# Altium schematic sheet ARCHITECTURE.SchDoc: Architecture
size 420 x 297 mm; SheetNumber: 1
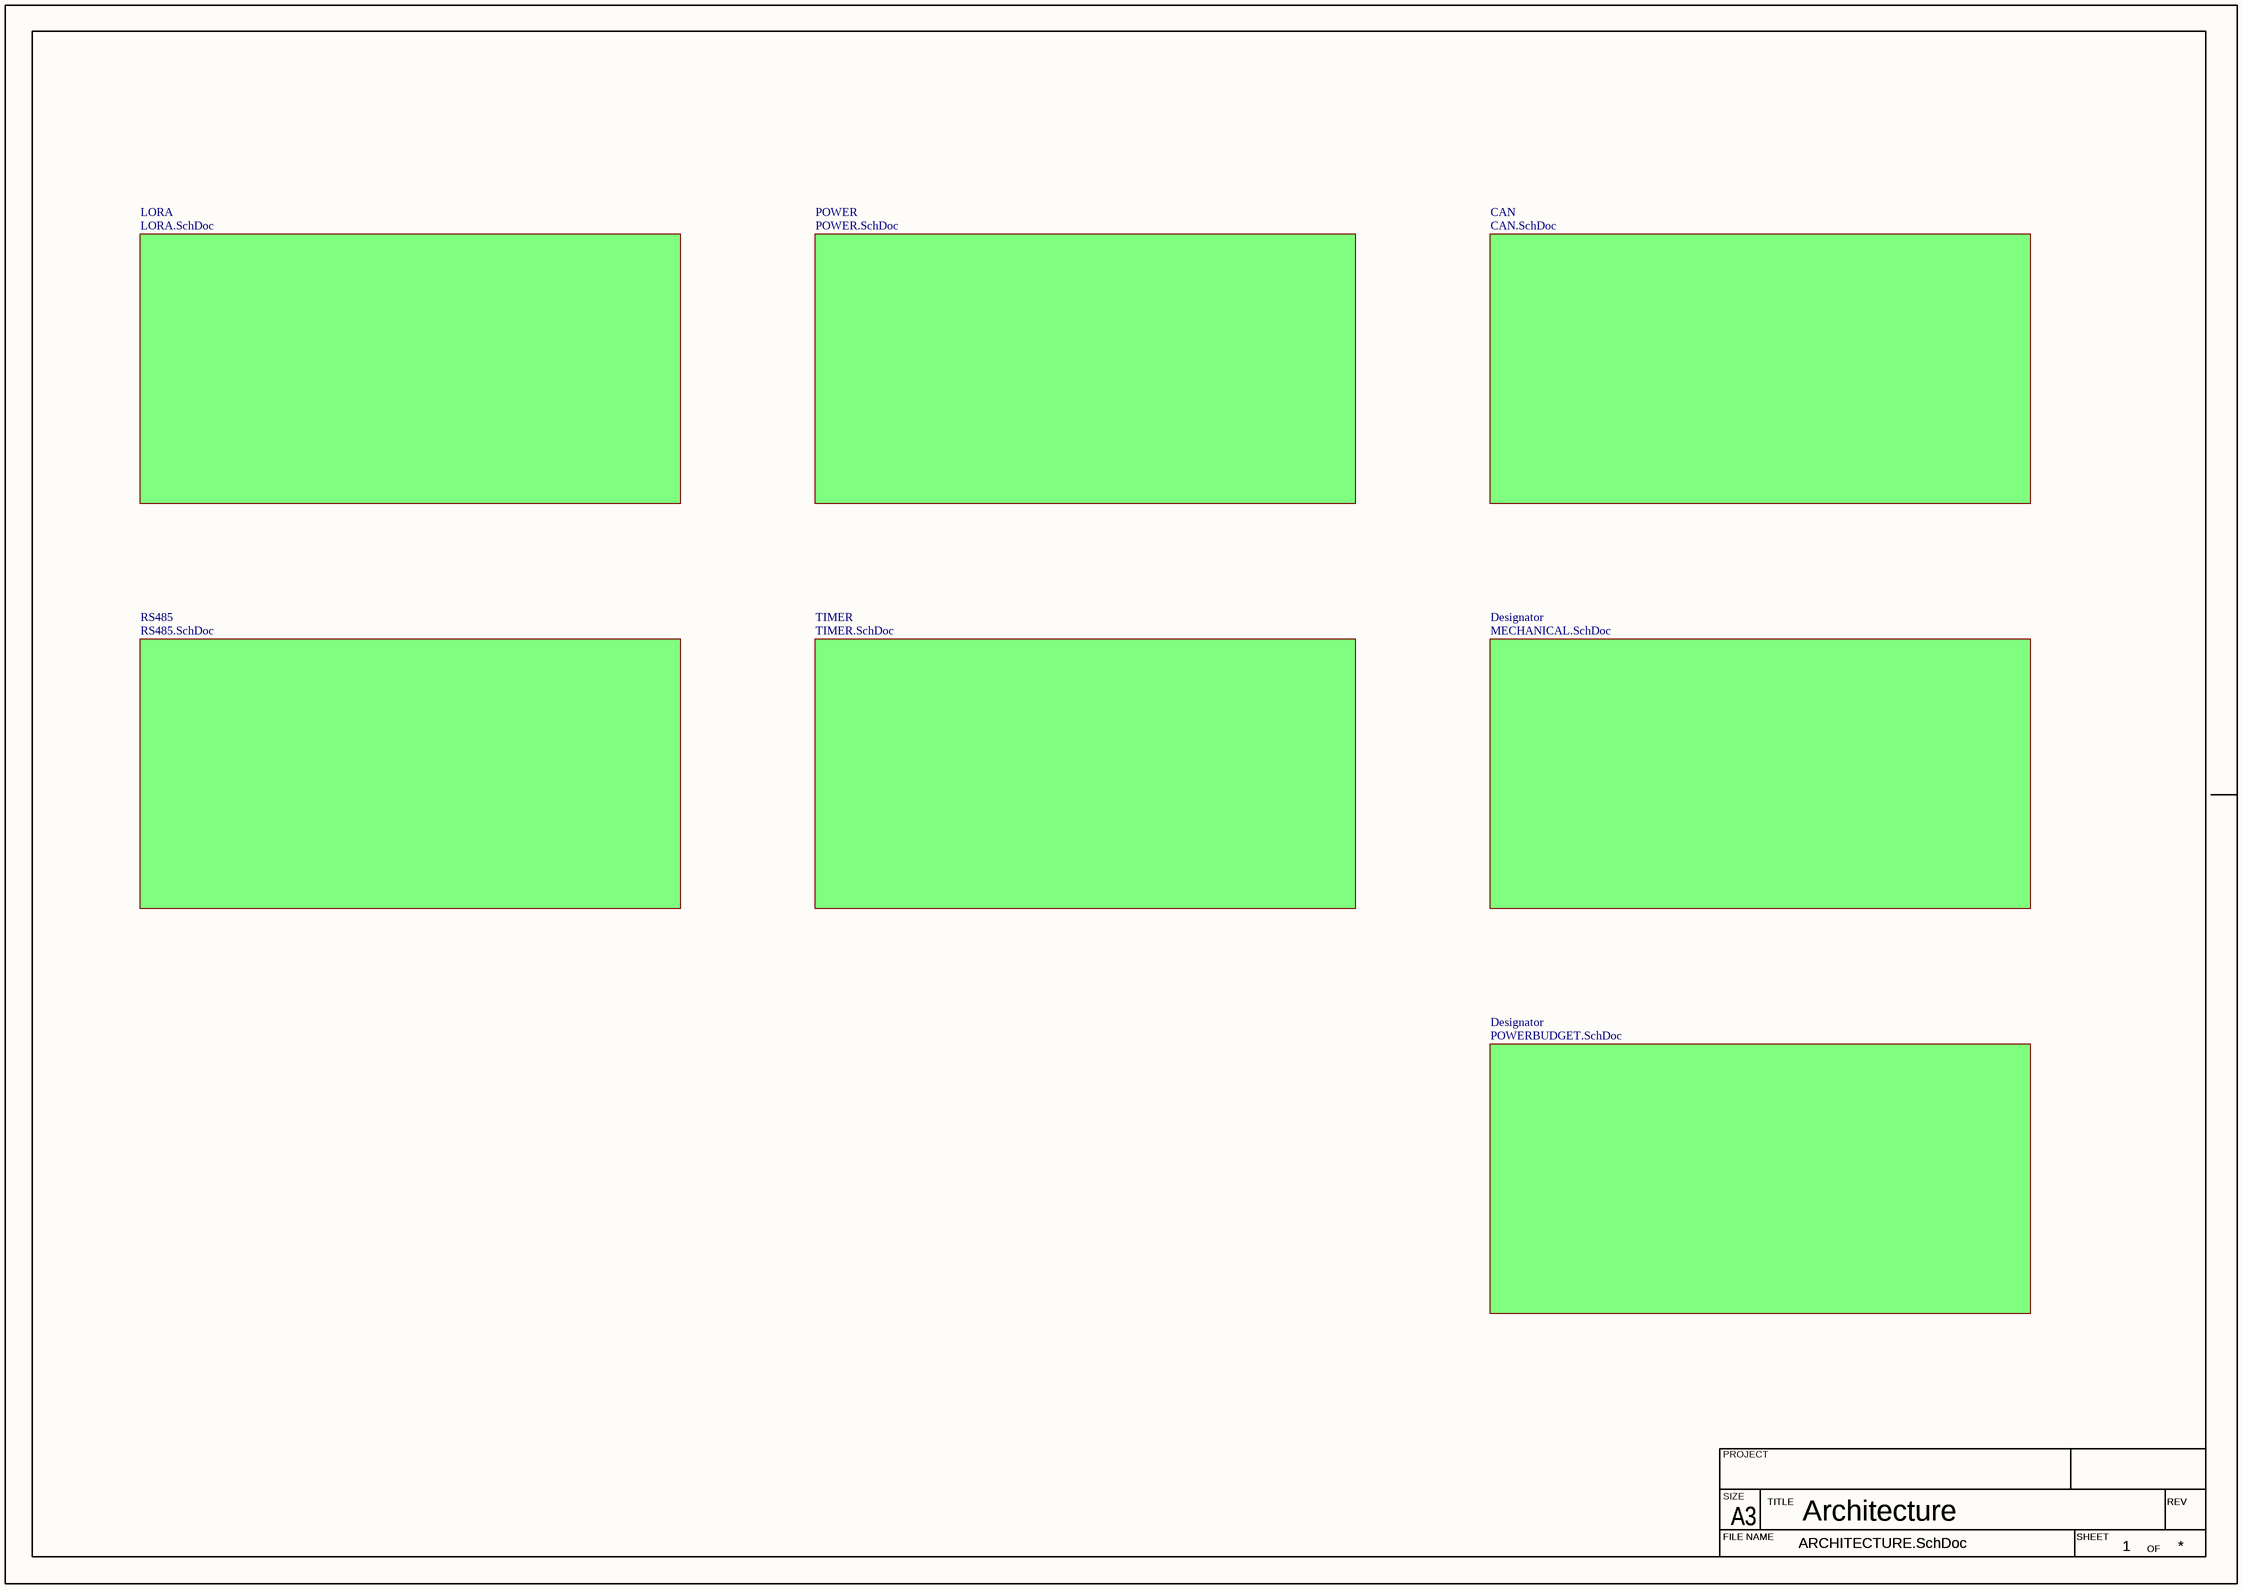
[diagram p0: ARCHITECTURE.SchDoc]

## Sub-sheets
CAN = CAN.SchDoc: no entries
Designator = MECHANICAL.SchDoc: no entries
Designator = POWERBUDGET.SchDoc: no entries
LORA = LORA.SchDoc: no entries
POWER = POWER.SchDoc: no entries
RS485 = RS485.SchDoc: no entries
TIMER = TIMER.SchDoc: no entries

## Notes on the sheet
- PROJECT
- SIZE
- FILE NAME
- A3
- TITLE
- SHEET
- OF
- REV